# EasyEDA Pro project ProProject_PetCareSTM32_MiniSTM32_2024-08-19_2.epro

# Schematic Schematic1
Create Date: 2024-08-11; Page Name: P1; Project Name: PetCareSTM32_MiniSTM32; Schematic Name: Schematic1; Update Date: 2024-08-19; Company: 嘉立创EDA; Page Size: A4; Version: V1.0
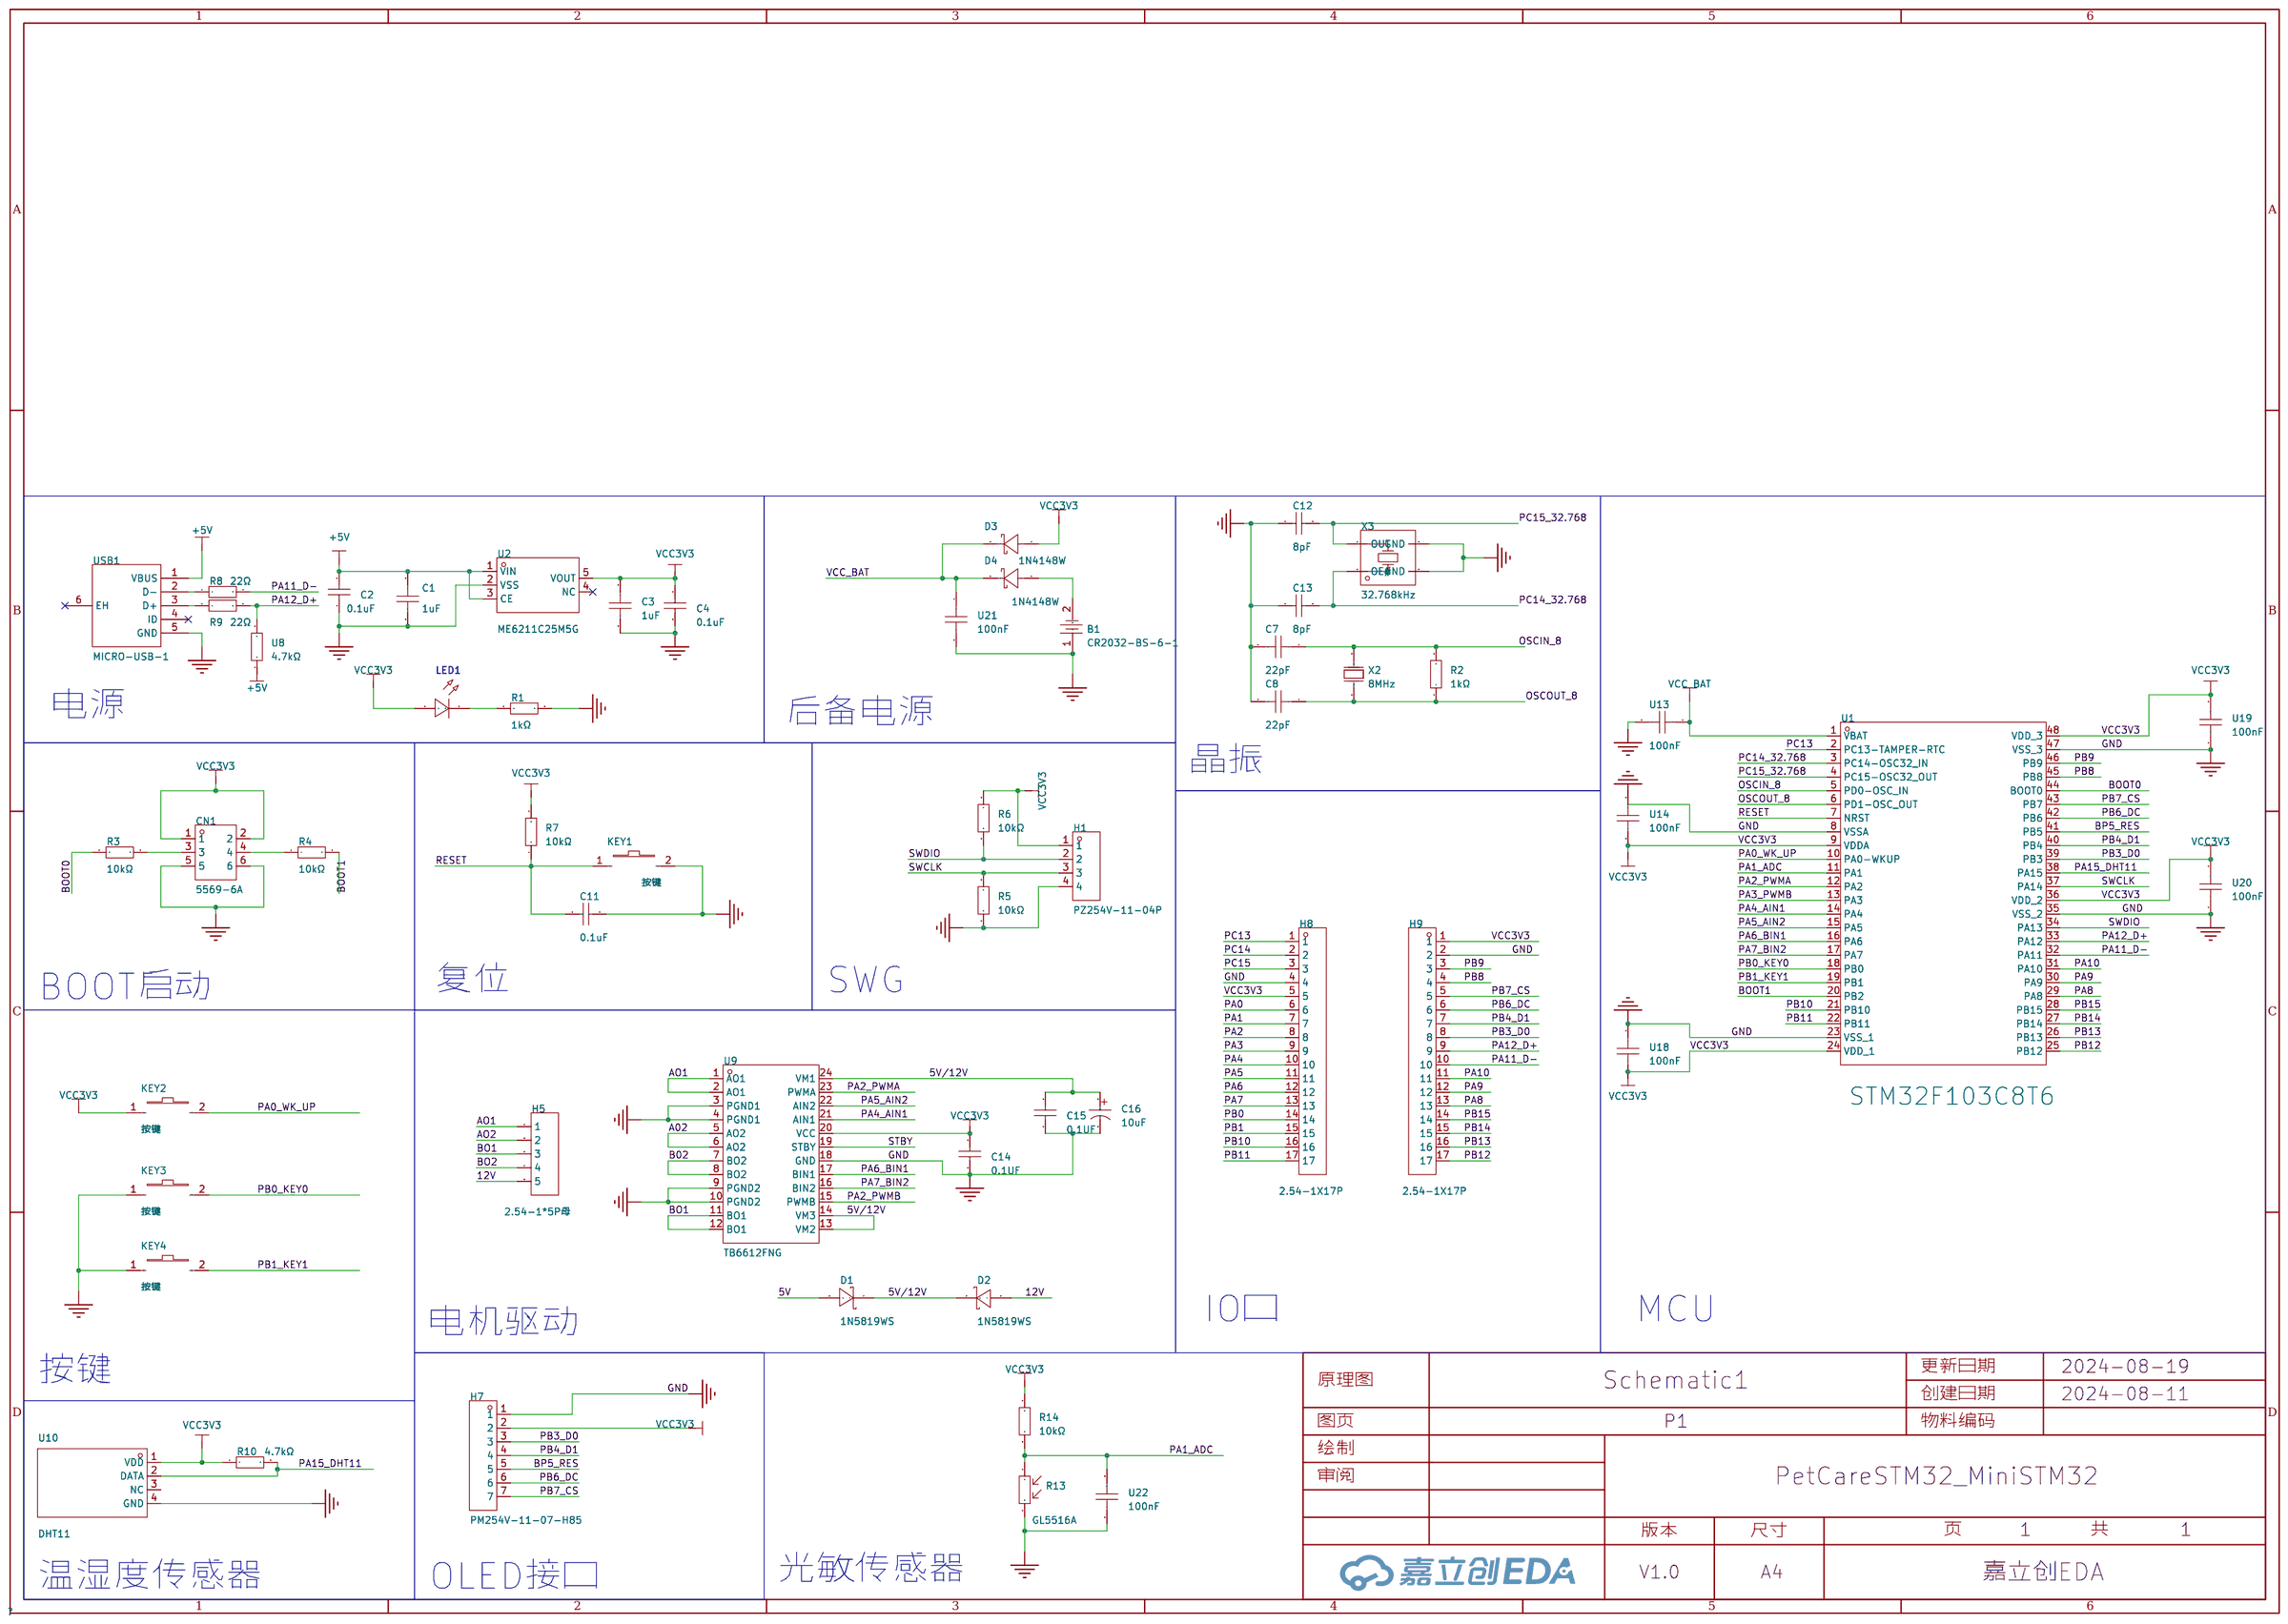
[diagram p0: schematic sheet]

## Parts
B1  CR2032-BS-6-1  [BAT-TH_CR2032-BS-6-1]
C1  1uF  [C0603]
C2  0.1uF  [C0603]
C3  1uF  [C0603]
C4  0.1uF  [C0603]
C7  22pF  [C0603]
C8  22pF  [C0603]
C11  0.1uF  [C0603]
C12  8pF  [C0603]
C13  8pF  [C0603]
C14  0.1UF  [C0603]
C15  0.1UF  [C0603]
C16  10uF  [CAP-TH_BD5.0-P2.00-D0.8-FD]
CN1  5569-6A  [CONN-TH_6P-P4.20_5569-6A-1]
D1  1N5819WS  [SOD-323_L1.8-W1.3-LS2.5-RD]
D2  1N5819WS  [SOD-323_L1.8-W1.3-LS2.5-RD]
D3  1N4148W  [SOD-123_L2.7-W1.6-LS3.7-FD]
D4  1N4148W  [SOD-123_L2.7-W1.6-LS3.7-FD]
H1  PZ254V-11-04P  [HDR-TH_4P-P2.54-V-M]
H5  2.54-1*5P母  [HDR-TH_5P-P2.54-V-F]
H7  PM254V-11-07-H85  [HDR-TH_7P-P2.54-V-F]
H8  2.54-1X17P  [HDR-TH_17P-P2.54-V-M]
H9  2.54-1X17P  [HDR-TH_17P-P2.54-V-M]
KEY1  按键  [SW-SMD_L6.0-W3.6-LS8.0]
KEY2  按键  [SW-SMD_L6.0-W3.6-LS8.0]
KEY3  按键  [SW-SMD_L6.0-W3.6-LS8.0]
KEY4  按键  [SW-SMD_L6.0-W3.6-LS8.0]
LED1  -  [LED_0805]
R1  1kΩ  [R0603]
R2  1kΩ  [R0603]
R3  10kΩ  [R0603]
R4  10kΩ  [R0603]
R5  10kΩ  [R0603]
R6  10kΩ  [R0603]
R7  10kΩ  [R0603]
R8  22Ω  [R0805]
R9  22Ω  [R0805]
R10  4.7kΩ  [R1206]
R13  GL5516A  [RES-TH_L5.1-W4.3-P3.40_GL55]
R14  10kΩ  [R0603]
U1  STM32F103C8T6  [LQFP-48_L7.0-W7.0-P0.50-LS9.0-BL]
U2  ME6211C25M5G  [SOT-23-5_L2.9-W1.7-P0.95-LS2.8-BL]
U8  4.7kΩ  [R0603]
U9  TB6612FNG  [SSOP-24_L8.4-W5.8-P0.65-LS7.8-BL]
U10  DHT11  [SENSOR-TH_DHT11]
U13  100nF  [C0603]
U14  100nF  [C0603]
U18  100nF  [C0603]
U19  100nF  [C0603]
U20  100nF  [C0603]
U21  100nF  [C0603]
U22  100nF  [C0603]
USB1  MICRO-USB-1  [MICRO-USB-SMD_C9900008946]
X2  8MHz  [OSC-SMD_L5.0-W3.2]
X3  32.768kHz  [CRYSTAL-SMD_4P-L8.0-W3.8-BL]

## Library data of the parts
B1 = CR2032-BS-6-1: 连接器类型:电池底座;适用电池规格:CR2032;工作温度范围:-;; LCSC Part Name: 电池底座 适用电池:CR2032; Supplier Part: C70377; Manufacturer: Q&J; Supplier Footprint: SMD; JLCPCB Part Class: Extended Part; Datasheet: https://atta.szlcsc.com/upload/public/pdf/source/20160427/1461725216549.pdf; Supplier: LCSC; Connector Type: 电池底座; Battery Type: CR2032
C1 C3 = CL10A105KB8NNNC: 容值:1uF;精度:±10%;额定电压:50V;材质(温度系数):X5R;; LCSC Part Name: 1uF ±10% 50V; Supplier Part: C15849; Manufacturer: SAMSUNG(三星); Supplier Footprint: 0603; JLCPCB Part Class: Basic Part; Datasheet: https://atta.szlcsc.com/upload/public/pdf/source/20160218/1457707763339.pdf; Supplier: LCSC; Tolerance: ±10%; Voltage Rated: 50V; Temperature Coefficient: X5R
C2 C4 C11 C14 C15 = CAPCER0.1UF16VX5R0603,CAPCER0.1UF25VX5R0603,CAPCER0.1UF16VX7R0603: Supplier Part: C9900012833; JLCPCB Part Class: Extended Part; Supplier: LCSC
C7 C8 = CL10C220JB81PNC: 容值:22pF;精度:±5%;额定电压:50V;材质(温度系数):C0G;; LCSC Part Name: 22pF ±5% 50V; Supplier Part: C170132; Manufacturer: SAMSUNG(三星); Supplier Footprint: 0603; JLCPCB Part Class: Extended Part; Datasheet: https://atta.szlcsc.com/upload/public/pdf/source/20180126/C170132_15169630833661310807.pdf; Supplier: LCSC; Tolerance: ±5%; Voltage Rated: 50V; Temperature Coefficient: C0G
C12 C13 = 0603CG8R0C500NT: 容值:8pF;额定电压:50V;材质(温度系数):C0G;; LCSC Part Name: 8pF 50V; Supplier Part: C36508; Manufacturer: FH(风华); Supplier Footprint: 0603; JLCPCB Part Class: Extended Part; Datasheet: https://atta.szlcsc.com/upload/public/pdf/source/20200305/C486355_26A10D38EF8C2A5C37091D0039909270.pdf; Supplier: LCSC; Voltage Rated: 50V; Temperature Coefficient: C0G
C16 = KF100M025C110A: 容值:10uF;精度:±20%;额定电压:25V;; LCSC Part Name: 10uF ±20% 25V; Supplier Part: C62930; Manufacturer: CapXon(丰宾); Supplier Footprint: 插件,D5xL11mm; JLCPCB Part Class: Extended Part; Datasheet: https://atta.szlcsc.com/upload/public/pdf/source/20160702/1467448308274.pdf; Supplier: LCSC; Tolerance: ±20%; Rated Voltage: 25V; Lead Spacing: 2mm; φD: 5mm; L: 11mm; Lifetime @ Temp: 2000hrs@105℃
CN1 = 5569-6A: Supplier Part: C9900070523; Supplier Footprint: 2*3p; JLCPCB Part Class: Extended Part; Supplier: LCSC
D1 D2 = 1N5819WS_C191023: 正向压降(Vf):600mV@1A;直流反向耐压(Vr):40V;平均整流电流(Io):1A;; LCSC Part Name: 电压:40V 电流:1A; Supplier Part: C191023; Manufacturer: Hottech(合科泰); Supplier Footprint: SOD-323; JLCPCB Part Class: Basic Part; Datasheet: https://atta.szlcsc.com/upload/public/pdf/source/20220428/3CB86FD8D28D653594B4E35F9D5AEFD9.pdf; Supplier: LCSC; Forward Voltage (Vf@If): 600mV@1A; Reverse Voltage (Vr): 40V; Average Rectified Current (Io): 1A
D3 D4 = 1N4148W_C7420318: 二极管配置:独立式;正向压降(Vf):1.25V@150mA;直流反向耐压(Vr):100V;平均整流电流(Io):150mA;功率:400mW;反向恢复时间(trr):4ns;; LCSC Part Name: 电压:100V 电流:150mA; Supplier Part: C7420318; Manufacturer: 宏迦橙; Supplier Footprint: SOD-123; JLCPCB Part Class: Extended Part; Datasheet: https://atta.szlcsc.com/upload/public/pdf/source/20230828/E5C3F7A4272052930A7E03B75759BF50.pdf; Supplier: LCSC; Diode Configuration: 独立式; Forward Voltage (Vf@If): 1.25V@150mA; Reverse Voltage (Vr): 100V; Average Rectified Current (Io): 150mA; Power Dissipation: 400mW; Reverse Leakage Current: 1uA@75V; Reverse Recovery Time (trr): 4ns; Operating Temperature: -55℃~+150℃
H1 = PZ254V-11-04P: 插针结构:1x4P;间距:2.54mm;行距:-;圆针/方针:方针;安装类型:直插;排数:单排;总PIN位数:4P;额定电流:3A;额定电压:250V;配合针长度:6mm;塑高:2.5mm;端接针长度:3mm;触头材质:-;工作温度范围:-40℃~+105℃;颜色:黑色;; LCSC Part Name: 间距:2.54mm 1x4P 直插 方针; Supplier Part: C2691448; Manufacturer: XFCN(兴飞); Supplier Footprint: 插件,P=2.54mm; JLCPCB Part Class: Extended Part; Datasheet: https://atta.szlcsc.com/upload/public/pdf/source/20200309/C492403_F9F19131791D08044AD4F84F8E751A34.pdf; Supplier: LCSC; Pin Structure: 1x4P; Pitch: 2.54mm; Circluar Pins/Square Pins: 方针; Mounting Type: 直插; Number of Rows: 单排; Number of Pins: 4P; Current Rating (Max): 3A; Voltage Rating (Max): 250V; Length of Mating Pin: 6mm; Insulation Height: 2.5mm; Length of End Connection Pin: 3mm; Operating Temperature Range: -40℃~+105℃; Color: 黑色
H5 = 2.54-1*5P母: 插孔结构:1x5P;间距:2.54mm;行距:-;安装类型:直插;排数:单排;总孔位数:5P;塑高:-;触头材质:-;触头镀层:-;; LCSC Part Name: 间距:2.54mm 1x5P 直插; Supplier Part: C50950; Manufacturer: BOOMELE(博穆精密); Supplier Footprint: 插件,P=2.54mm; JLCPCB Part Class: Extended Part; Datasheet: https://atta.szlcsc.com/upload/public/pdf/source/20210301/C2718488_F4427B881E42CAA8DDB0B1C12B3A522C.pdf; Supplier: LCSC; Holes Structure: 1x5P; Pitch: 2.54mm; Mounting Type: 直插; Number of Rows: 单排; Number of Holes: 5P
H7 = PM254V-11-07-H85: 插孔结构:1x7P;间距:2.54mm;行距:-;圆孔/方孔:方孔;安装类型:直插;排数:单排;总孔位数:7P;额定电流:3A;额定电压:250V;插孔方向:顶部;塑高:-;工作温度范围:-40℃~+105℃;; LCSC Part Name: 间距:2.54mm 1x7P 直插; Supplier Part: C2832270; Manufacturer: XFCN(兴飞); Supplier Footprint: 插件,P=2.54mm; JLCPCB Part Class: Extended Part; Datasheet: https://atta.szlcsc.com/upload/public/pdf/source/20210514/C2832270_F424CC0071A81298BFB56B53406F9842.pdf; Supplier: LCSC; Holes Structure: 1x7P; Pitch: 2.54mm; Circular Hole / Square Hole: 方孔; Mounting Type: 直插; Number of Rows: 单排; Number of Holes: 7P; Current Rating (Max): 3A; Voltage Rating (Max): 250V; Holes Direction: 顶部; Operating Temperature Range: -40℃~+105℃
H8 H9 = KH-2.54PH180-1X17P-L11.5: 插针结构:1x17P;间距:2.54mm;行距:-;圆针/方针:方针;安装类型:直插;排数:单排;总PIN位数:17P;额定电流:3A;额定电压:-;配合针长度:6mm;塑高:2.5mm;端接针长度:3mm;工作温度范围:-40℃~+105℃;颜色:黑色;; LCSC Part Name: 间距:2.54mm 1x17P 直插 方针; Supplier Part: C2932705; Manufacturer: kinghelm(金航标); Supplier Footprint: 插件,P=2.54mm; JLCPCB Part Class: Extended Part; Datasheet: https://atta.szlcsc.com/upload/public/pdf/source/20211220/20932CDD9C2552710798341E35ADE8E4.pdf; Supplier: LCSC; Pin Structure: 1x17P; Pitch: 2.54mm; Circluar Pins/Square Pins: 方针; Mounting Type: 直插; Number of Rows: 单排; Number of Pins: 17P; Current Rating (Max): 3A; Length of Mating Pin: 6mm; Insulation Height: 2.5mm; Length of End Connection Pin: 3mm; Operating Temperature Range: -40℃~+105℃; Color: 黑色
KEY1-KEY4 = 轻触按键 3x6x2.5mm: LCSC Part Name: 3x6x2.5 红头 耐高温; Supplier Part: C5382; Supplier Footprint: SMD; JLCPCB Part Class: Extended Part; Supplier: LCSC
LED1 = LED_0805-B: Supplier Footprint: 0805
R1 = RC0603FR-071KL: 电阻类型:厚膜电阻;阻值:1kΩ;精度:±1%;功率:100mW;最大工作电压:75V;温度系数:±100ppm/℃;; LCSC Part Name: 厚膜电阻 1kΩ ±1% 100mW; Supplier Part: C22548; Manufacturer: YAGEO(国巨); Supplier Footprint: 0603; JLCPCB Part Class: Extended Part; Datasheet: https://atta.szlcsc.com/upload/public/pdf/source/20180316/70C0E2BDAE7FCC62C531A5A58D202EE1.pdf; Supplier: LCSC; Type: 厚膜电阻; Tolerance: ±1%; Power(Watts): 100mW; Overload Voltage (Max): 75V; Temperature Coefficient: ±100ppm/℃; Operating Temperature Range: -55℃~+155℃
R2 = 0603WAD1001T5E: 电阻类型:厚膜电阻;阻值:1kΩ;精度:±0.5%;功率:100mW;最大工作电压:75V;温度系数:±100ppm/℃;; LCSC Part Name: 1kΩ ±0.5% 100mW 厚膜电阻; Supplier Part: C51218; Manufacturer: UNI-ROYAL(厚声); Supplier Footprint: 0603; JLCPCB Part Class: Extended Part; Datasheet: https://atta.szlcsc.com/upload/public/pdf/source/20200306/C422600_1E6D84923E4A46A82E41ADD87F860B5C.pdf; Supplier: LCSC; Type: 厚膜电阻; Tolerance: ±0.5%; Power(Watts): 100mW; Overload Voltage (Max): 75V; Temperature Coefficient: ±100ppm/℃; Operating Temperature Range: -55℃~+155℃
R3-R7 R14 = 0603WAF1002T5E: 电阻类型:厚膜电阻;阻值:10kΩ;精度:±1%;功率:100mW;最大工作电压:75V;温度系数:±100ppm/℃;; LCSC Part Name: 厚膜电阻 10kΩ ±1% 100mW; Supplier Part: C25804; Manufacturer: UNI-ROYAL(厚声); Supplier Footprint: 0603; JLCPCB Part Class: Basic Part; Datasheet: https://atta.szlcsc.com/upload/public/pdf/source/20200306/C422600_1E6D84923E4A46A82E41ADD87F860B5C.pdf; Supplier: LCSC; Type: 厚膜电阻; Tolerance: ±1%; Power(Watts): 100mW; Overload Voltage (Max): 75V; Temperature Coefficient: ±100ppm/℃; Operating Temperature Range: -55℃~+155℃
R8 R9 = TC0525F220JT5E: 电阻类型:薄膜电阻;阻值:22Ω;精度:±1%;功率:250mW;最大工作电压:150V;温度系数:±25ppm/℃;; LCSC Part Name: 22Ω ±1% 250mW 薄膜电阻; Supplier Part: C65068; Manufacturer: UNI-ROYAL(厚声); Supplier Footprint: 0805; JLCPCB Part Class: Extended Part; Datasheet: https://atta.szlcsc.com/upload/public/pdf/source/20190904/C425668_F2F639A313B6F33D501F342892FD5229.pdf; Supplier: LCSC; Type: 薄膜电阻; Tolerance: ±1%; Power(Watts): 250mW; Overload Voltage (Max): 150V; Temperature Coefficient: ±25ppm/℃; Operating Temperature Range: -55℃~+155℃
R10 = 1206W4F4701T5E: 电阻类型:厚膜电阻;阻值:4.7kΩ;精度:±1%;功率:250mW;最大工作电压:200V;温度系数:±100ppm/℃;; LCSC Part Name: 4.7kΩ ±1% 250mW 厚膜电阻; Supplier Part: C17936; Manufacturer: UNI-ROYAL(厚声); Supplier Footprint: 1206; JLCPCB Part Class: Basic Part; Datasheet: https://atta.szlcsc.com/upload/public/pdf/source/20200306/C422600_1E6D84923E4A46A82E41ADD87F860B5C.pdf; Supplier: LCSC; Type: 厚膜电阻; Tolerance: ±1%; Power(Watts): 250mW; Overload Voltage (Max): 200V; Temperature Coefficient: ±100ppm/℃; Operating Temperature Range: -55℃~+155℃
R13 = GL5516A（5-10K）: 暗电阻:200kΩ;亮电阻 @ 10Lux:5kΩ~10kΩ;光谱峰值(波长):540nm;; LCSC Part Name: 亮电阻:5kΩ~10kΩ 暗电阻:200kΩ; Supplier Part: C11307; Manufacturer: JCHL(晶创和立); Supplier Footprint: 插件,P=3.4mm; JLCPCB Part Class: Extended Part; Datasheet: https://atta.szlcsc.com/upload/public/pdf/source/20200417/C515010_C10502EF7F431E893A7F20DB83F527F0.pdf; Supplier: LCSC; Dark Resistance: 200kΩ; Illuminated Resistance @ 10Lux: 5kΩ~10kΩ; Applied Voltage: 150V; Spectral Peak: 540nm
U1 = STM32F103C8T6: CPU内核:ARM-M3;程序存储容量:64KB;RAM总容量:20KB;GPIO端口数量:37;工作电压范围:2V~3.6V;CPU最大主频:72MHz;程序存储器类型:FLASH;; LCSC Part Name: 主流增强型ARM Cortex-M3 MCU，具有64 KB Flash、72 MHz CPU、电机控制、USB和CAN; Supplier Part: C8734; Manufacturer: ST(意法半导体); Supplier Footprint: LQFP-48(7x7); JLCPCB Part Class: 扩展库; Datasheet: https://atta.szlcsc.com/upload/public/pdf/source/20220812/8363ACEC51AD55ECEB84799464F7CB85.pdf; Supplier: LCSC; CPU Core: ARM-M3; Program Storage Size: 64KB; RAM Size: 20KB; GPIO Ports Number: 37; Operating Voltage Range: 2V~3.6V; CPU Maximum Speed: 72MHz; Program Memory Type: FLASH; Operating Temperature Range: -40℃~+85℃; ADC (Bit): 12bit; Universal Serial Bus: 有; Peripheral/Function: 看门狗；DMA；看门狗；温度传感器; Watchdog: 有; Infrared Data Association: 有; Low-Voltage Detect: 有; Direct Memory Access: 有; Internal Oscillator: 有
U2 = ME6211C25M5G: LCSC Part Name: ME6211C25M5G 停产; Supplier Part: C2835813; Manufacturer: MICRONE(南京微盟); Supplier Footprint: SOT-23-5; JLCPCB Part Class: Extended Part; Datasheet: https://atta.szlcsc.com/upload/public/pdf/source/20211210/ACC7C3E9BA56F250BF966425916E32B9.pdf; Supplier: LCSC
U8 = AR03FTDX4701A: 电阻类型:薄膜电阻;阻值:4.7kΩ;精度:±1%;功率:100mW;最大工作电压:75V;温度系数:±50ppm/℃;; LCSC Part Name: 薄膜电阻 4.7kΩ ±1% 100mW; Supplier Part: C2924150; Manufacturer: Viking(光颉); Supplier Footprint: 0603; JLCPCB Part Class: Extended Part; Datasheet: https://atta.szlcsc.com/upload/public/pdf/source/20211123/7AFDB03DAF68AA91648A852AAE26A3AB.pdf; Supplier: LCSC; Type: 薄膜电阻; Tolerance: ±1%; Power(Watts): 100mW; Overload Voltage (Max): 75V; Temperature Coefficient: ±50ppm/℃; Operating Temperature Range: -55℃~+155℃
U9 = TB6612FNG(O,C,8,EL: 双直流电机驱动器集成电路; Supplier Part: C88224; Manufacturer: TOSHIBA(东芝); Supplier Footprint: SSOP-24-208mil; JLCPCB Part Class: Extended Part; Datasheet: https://atta.szlcsc.com/upload/public/pdf/source/20171128/C141517_15118625624231147036.pdf; Supplier: LCSC
U10 = DHT11: 新款电容式数字温湿度传感器,老款已停产16.1x12.6x5.8mm; LCSC Part Name: DHT11  电容式传感器; Supplier Part: C117051; Manufacturer: 广州奥松; Supplier Footprint: SIP-4; JLCPCB Part Class: Extended Part; Datasheet: https://atta.szlcsc.com/upload/public/pdf/source/20170703/1499081238365.pdf; Supplier: LCSC
U13 U14 U18-U22 = CGA0603X7R104K500JT: 容值:100nF;精度:±10%;额定电压:50V;材质(温度系数):X7R;; LCSC Part Name: 100nF ±10% 50V; Supplier Part: C6119867; Manufacturer: HRE(芯声); Supplier Footprint: 0603; JLCPCB Part Class: Extended Part; Supplier: LCSC; Tolerance: ±10%; Voltage Rated: 50V; Temperature Coefficient: X7R
USB1 = MICRO-USB-1: Supplier Part: C9900008946; Supplier Footprint: USB-micro; JLCPCB Part Class: Extended Part; Supplier: LCSC
X2 = ABM3-8.000MHZ-D2Y-T: 晶振类型:贴片晶振;频率:8MHz;常温频差:±20ppm;外接负载电容:18pF;频率稳定度(全温):±30ppm;; LCSC Part Name: 8MHz ±20ppm 18pF; Supplier Part: C144380; Manufacturer: ABRACON; Supplier Footprint: SMD5032; JLCPCB Part Class: Extended Part; Datasheet: https://atta.szlcsc.com/upload/public/pdf/source/20180613/C148313_0A3B1F233FF88ED3B220BE4C181ABF14.pdf; Supplier: LCSC; Crystal Type: 贴片晶振; Normal temperature Frequency Tolerance: ±20ppm; External load capacitor: 18pF; Frequency Stability(Full temperature range): ±30ppm; Equivalent Series Resistance (ESR): 140Ω; Operating Temperature: -40℃~+85℃
X3 = ABS25-32.768KHZ-T: 晶振类型:-;频率:32.768kHz;常温频差:±20ppm;外接负载电容:12.5pF;频率稳定度(全温):-;; LCSC Part Name: 32.768kHz ±20ppm 12.5pF; Supplier Part: C179637; Manufacturer: ABRACON; Supplier Footprint: MC-306; JLCPCB Part Class: 扩展库; Datasheet: https://atta.szlcsc.com/upload/public/pdf/source/20180207/C179637_15179896523281356363.pdf; Supplier: LCSC; Normal temperature Frequency Tolerance: ±20ppm; External load capacitor: 12.5pF; Equivalent Series Resistance (ESR): 50kΩ; Operating Temperature: -40℃~+85℃

## Nets
5V: D1.2(A)
5V/12V: C15.2 C16.1 D1.1(K) D2.1(K) U9.13(VM2) U9.14(VM3) U9.24(VM1)
12V: D2.2(A) H5.5
+5V: C1.2 C2.2 U2.1(VIN) U2.3(CE) U8.1 USB1.1(VBUS)
GND: B1.1 C1.1 C2.1 C3.1 C4.1 C7.2 C8.2 C11.2 C12.1 C13.1 C14.1 C15.1 C16.2 CN1.5 CN1.6 H1.4 H7.1 H8.4 H9.2 KEY1.2 KEY3.1 KEY4.1 R1.2 R5.1 R13.2 U1.8(VSSA) U1.23(VSS_1) U1.35(VSS_2) U1.47(VSS_3) U2.2(VSS) U9.3(PGND1) U9.4(PGND1) U9.9(PGND2) U9.10(PGND2) U9.18(GND) U10.4(GND) U13.2 U14.2 U18.2 U19.1 U20.1 U21.2 U22.1 USB1.5(GND) X3.2(GND) X3.3(GND)
VCC3V3: C3.2 C4.2 C14.2 CN1.1 CN1.2 D3.1(A) H1.1 H7.2 H8.5 H9.1 KEY2.1 LED1.2(A) R6.2 R7.2 R10.1 R14.2 U1.9(VDDA) U1.24(VDD_1) U1.36(VDD_2) U1.48(VDD_3) U2.5(VOUT) U9.20(VCC) U10.1(VDD) U14.1 U18.1 U19.2 U20.2
VCC_BAT: D3.2(K) D4.2(K) U1.1(VBAT) U13.1 U21.1
A02: U9.5(AO2) U9.6(AO2)
AO1: H5.1 U9.1(AO1) U9.2(AO1)
AO2: H5.2
B02: U9.7(BO2) U9.8(BO2)
BO1: H5.3 U9.11(BO1) U9.12(BO1)
BO2: H5.4
BOOT0: R3.1 U1.44(BOOT0)
BOOT1: R4.2 U1.20(PB2)
BP5_RES: H7.5 U1.41(PB5)
OSCIN_8: C7.1 R2.2 U1.5(PD0-OSC_IN) X2.2(OSC2)
OSCOUT_8: C8.1 R2.1 U1.6(PD1-OSC_OUT) X2.1(OSC1)
PA0: H8.6
PA0_WK_UP: KEY2.2 U1.10(PA0-WKUP)
PA1: H8.7
PA1_ADC: R13.1 R14.1 U1.11(PA1) U22.2
PA2: H8.8
PA2_PWMA: U1.12(PA2) U9.23(PWMA)
PA2_PWMB: U9.15(PWMB)
PA3: H8.9
PA3_PWMB: U1.13(PA3)
PA4: H8.10
PA4_AIN1: U1.14(PA4) U9.21(AIN1)
PA5: H8.11
PA5_AIN2: U1.15(PA5) U9.22(AIN2)
PA6: H8.12
PA6_BIN1: U1.16(PA6) U9.17(BIN1)
PA7: H8.13
PA7_BIN2: U1.17(PA7) U9.16(BIN2)
PA8: H9.13 U1.29(PA8)
PA9: H9.12 U1.30(PA9)
PA10: H9.11 U1.31(PA10)
PA11_D-: H9.10 R8.2 U1.32(PA11)
PA12_D+: H9.9 R9.2 U1.33(PA12) U8.2
PA15_DHT11: R10.2 U1.38(PA15) U10.2(DATA)
PB0: H8.14
PB0_KEY0: KEY3.2 U1.18(PB0)
PB1: H8.15
PB1_KEY1: KEY4.2 U1.19(PB1)
PB3_D0: H7.3 H9.8 U1.39(PB3)
PB4_D1: H7.4 H9.7 U1.40(PB4)
PB6_DC: H7.6 H9.6 U1.42(PB6)
PB7_CS: H7.7 H9.5 U1.43(PB7)
PB8: H9.4 U1.45(PB8)
PB9: H9.3 U1.46(PB9)
PB10: H8.16 U1.21(PB10)
PB11: H8.17 U1.22(PB11)
PB12: H9.17 U1.25(PB12)
PB13: H9.16 U1.26(PB13)
PB14: H9.15 U1.27(PB14)
PB15: H9.14 U1.28(PB15)
PC13: H8.1 U1.2(PC13-TAMPER-RTC)
PC14: H8.2
PC14_32.768: C13.2 U1.3(PC14-OSC32_IN) X3.1(OE#)
PC15: H8.3
PC15_32.768: C12.2 U1.4(PC15-OSC32_OUT) X3.4(OUT)
RESET: C11.1 KEY1.1 R7.1 U1.7(NRST)
STBY: U9.19(STBY)
SWCLK: H1.3 R5.2 U1.37(PA14)
SWDIO: H1.2 R6.1 U1.34(PA13)
Net-(B1-2): B1.2 D4.1(A)
Net-(CN1-3): CN1.3 R3.2
Net-(CN1-4): CN1.4 R4.1
Net-(LED1-1): LED1.1(C) R1.1
Net-(R8-1): R8.1 USB1.2(D-)
Net-(R9-1): R9.1 USB1.3(D+)

Not connected (* = marked no-connect by the designer): U2 4(NC)*; U10 3(NC); USB1 4(ID)* 6(EH)*

## Notes on the sheet
- 电源
- 后备电源
- 晶振
- BOOT启动
- 复位
- SWG
- IO口
- MCU
- 电机驱动
- 按键
- 光敏传感器
- 温湿度传感器
- OLED接口
